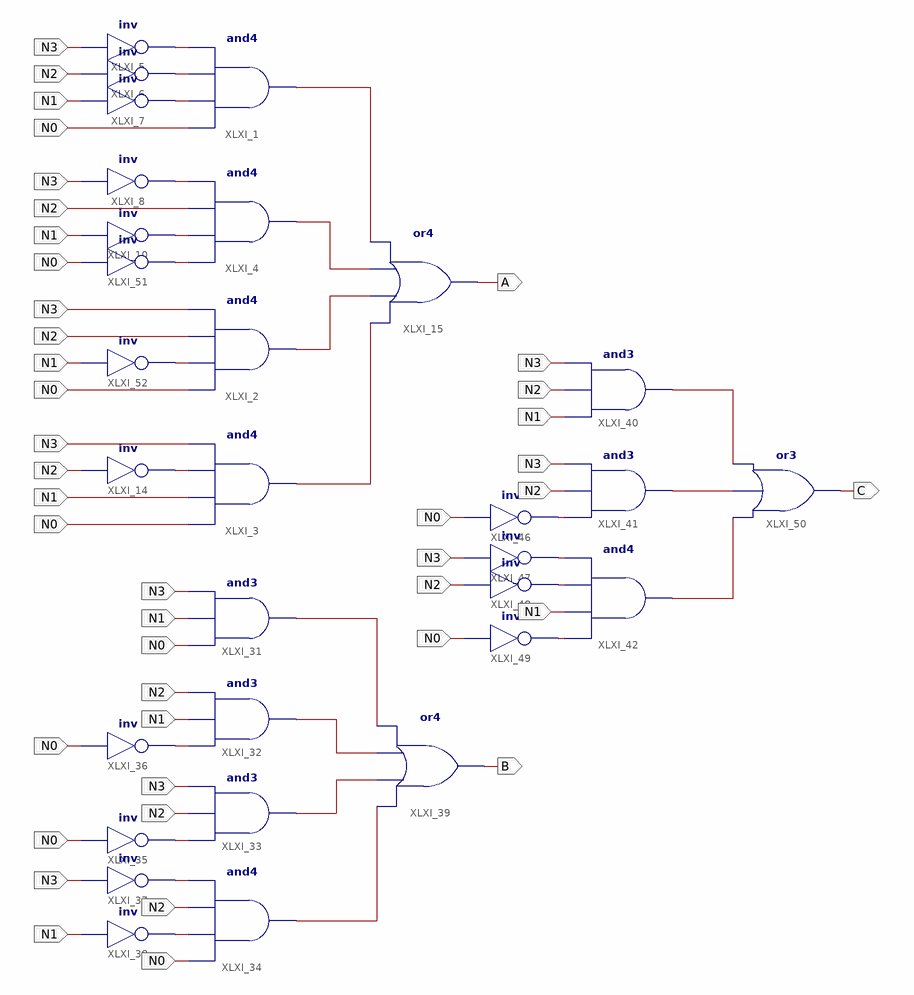
[diagram p0: schematic sheet 1]
// Xilinx ISE schematic abc.sch (spartan3e) as structural Verilog: 30 symbols, 7 ports
module abc (
  input  N3,
  input  N2,
  input  N1,
  input  N0,
  output A,
  output B,
  output C
);

  wire XLXN_1, XLXN_2, XLXN_3, XLXN_8, XLXN_10, XLXN_12, XLXN_14, XLXN_27, XLXN_28, XLXN_29, XLXN_30,
       XLXN_64, XLXN_65, XLXN_66, XLXN_67, XLXN_81, XLXN_82, XLXN_83, XLXN_84, XLXN_96, XLXN_97, XLXN_98,
       XLXN_99, XLXN_100, XLXN_101, XLXN_102, XLXN_104;

  and XLXI_1 (XLXN_27, N0, XLXN_3, XLXN_2, XLXN_1);
  not XLXI_5 (XLXN_1, N3);
  not XLXI_6 (XLXN_2, N2);
  not XLXI_7 (XLXN_3, N1);
  and XLXI_4 (XLXN_28, XLXN_104, XLXN_10, N2, XLXN_8);
  not XLXI_8 (XLXN_8, N3);
  not XLXI_10 (XLXN_10, N1);
  and XLXI_2 (XLXN_29, N0, XLXN_12, N2, N3);
  and XLXI_3 (XLXN_30, N0, N1, XLXN_14, N3);
  not XLXI_14 (XLXN_14, N2);
  or XLXI_15 (A, XLXN_30, XLXN_29, XLXN_28, XLXN_27);
  and XLXI_31 (XLXN_81, N0, N1, N3);
  and XLXI_32 (XLXN_82, XLXN_64, N1, N2);
  and XLXI_33 (XLXN_83, XLXN_65, N2, N3);
  and XLXI_34 (XLXN_84, N0, XLXN_67, N2, XLXN_66);
  not XLXI_35 (XLXN_65, N0);
  not XLXI_36 (XLXN_64, N0);
  not XLXI_37 (XLXN_66, N3);
  not XLXI_38 (XLXN_67, N1);
  or XLXI_39 (B, XLXN_84, XLXN_83, XLXN_82, XLXN_81);
  and XLXI_40 (XLXN_100, N1, N2, N3);
  and XLXI_41 (XLXN_101, XLXN_96, N2, N3);
  and XLXI_42 (XLXN_102, XLXN_99, N1, XLXN_98, XLXN_97);
  not XLXI_46 (XLXN_96, N0);
  not XLXI_47 (XLXN_97, N3);
  not XLXI_48 (XLXN_98, N2);
  not XLXI_49 (XLXN_99, N0);
  or XLXI_50 (C, XLXN_102, XLXN_101, XLXN_100);
  not XLXI_51 (XLXN_104, N0);
  not XLXI_52 (XLXN_12, N1);
endmodule
